# Altium schematic sheet Nucleo PCB V1.1.SchDoc
size A2; SheetNumber: 1; SheetTotal: 1
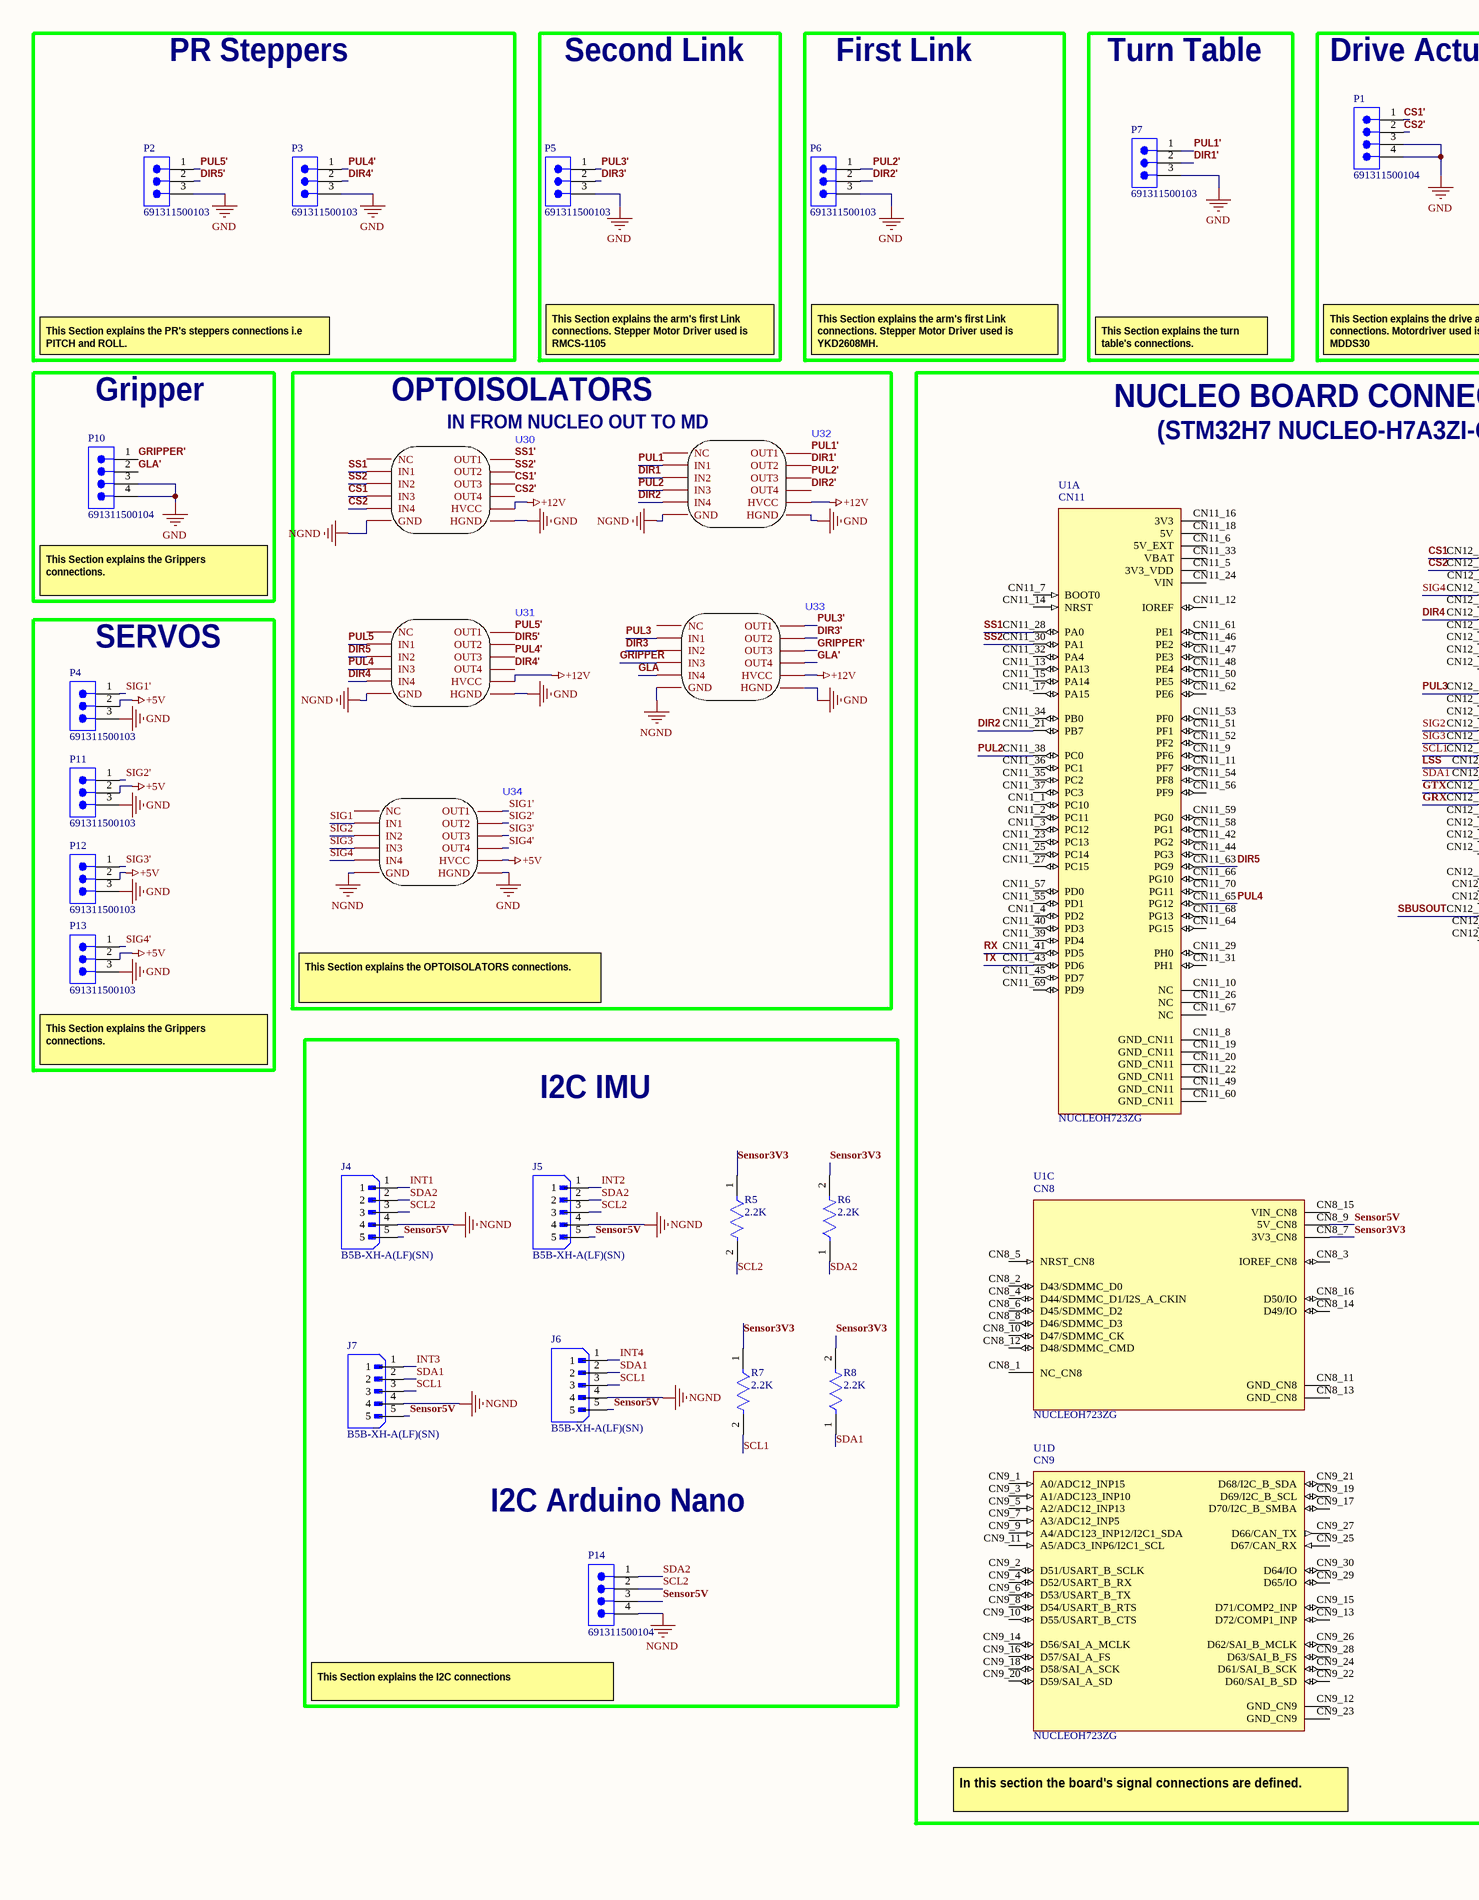
[diagram p0: Nucleo PCB V1.1.SchDoc, left]
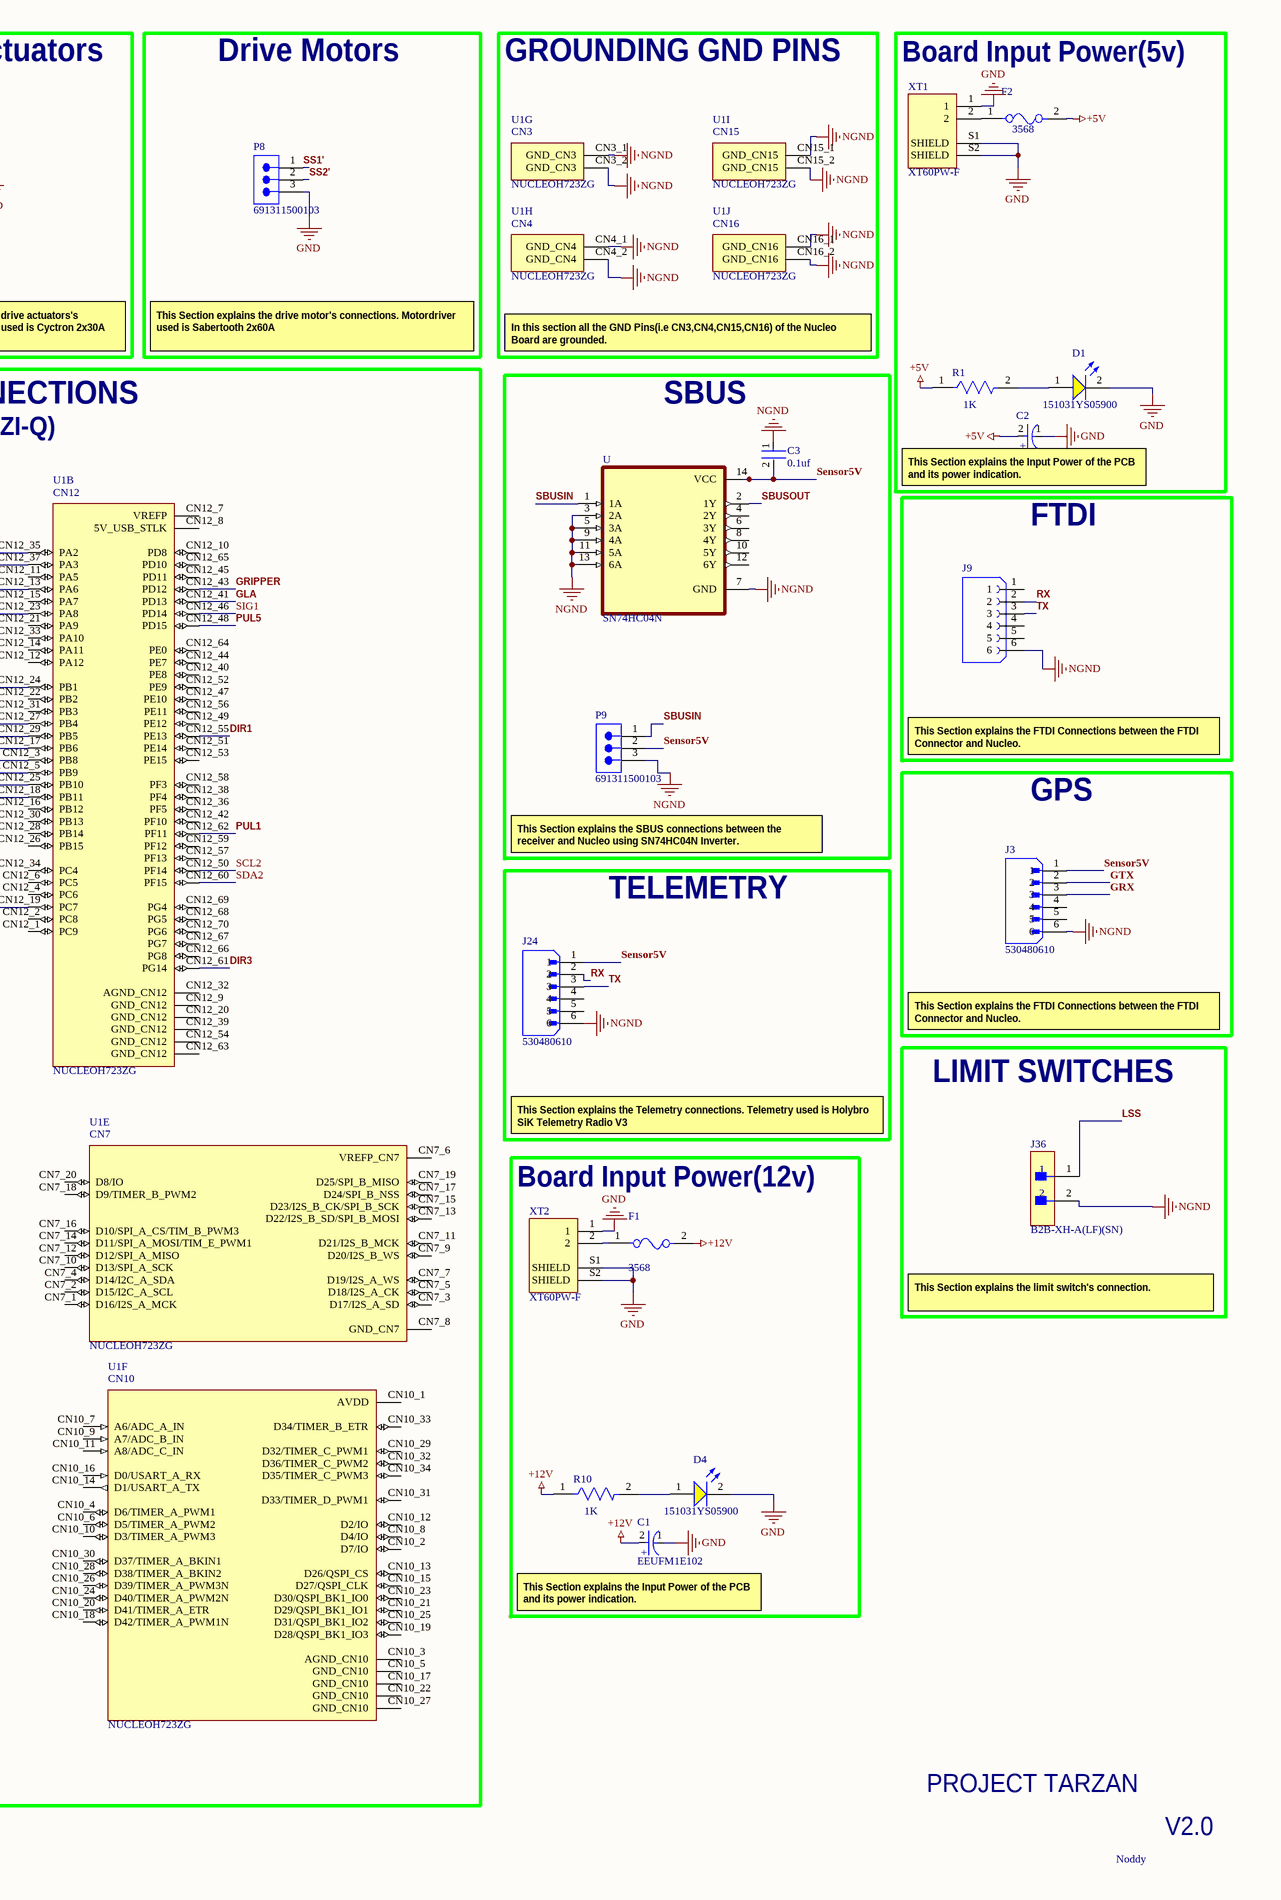
[diagram p1: Nucleo PCB V1.1.SchDoc, right]

## Parts
C1  EEUFM1E102  [FP-RAD-TH-D_12_5_0_5-L_20-MFG]
C2  EEUFM1E102  [FP-RAD-TH-D_12_5_0_5-L_20-MFG]
C3  0.1uf  [FP-VY1472M63Y5UQ6TV0-MFG]
D1  151031YS05900  [WL-TMRC_D3.95H5.3]
D4  151031YS05900  [WL-TMRC_D3.95H5.3]
F1  3568  [FP-3568-MFG]
F2  3568  [FP-3568-MFG]
J3  530480610  [MOLEX_530480610]
J4  B5B-XH-A(LF)(SN)  [JST_B5B-XH-A(LF)(SN)]
J5  B5B-XH-A(LF)(SN)  [JST_B5B-XH-A(LF)(SN)]
J6  B5B-XH-A(LF)(SN)  [JST_B5B-XH-A(LF)(SN)]
J7  B5B-XH-A(LF)(SN)  [JST_B5B-XH-A(LF)(SN)]
J9  PPTC061LFBN-RC  [SULLINS_PPTC061LFBN-RC]  (value not drawn)
J24  530480610  [MOLEX_530480610]
J36  B2B-XH-A(LF)(SN)  [FP-B2B-XH-A_LF_SN-MFG]
P1  691311500104  [691311500104]
P2  691311500103  [691311500103]
P3  691311500103  [691311500103]
P4  691311500103  [691311500103]
P5  691311500103  [691311500103]
P6  691311500103  [691311500103]
P7  691311500103  [691311500103]
P8  691311500103  [691311500103]
P9  691311500103  [691311500103]
P10  691311500104  [691311500104]
P11  691311500103  [691311500103]
P12  691311500103  [691311500103]
P13  691311500103  [691311500103]
P14  691311500104  [691311500104]
R1  1K  [FP-MRS25-MFG]
R5  2.2K  [FP-MRS25-MFG]
R6  2.2K  [FP-MRS25-MFG]
R7  2.2K  [FP-MRS25-MFG]
R8  2.2K  [FP-MRS25-MFG]
R10  1K  [FP-MRS25-MFG]
U  SN74HC04N  [DIP794W45P254L1969H508Q14]
U1  NUCLEOH723ZG  [MODULE_NUCLEOH723ZG]  (parts A,B,C,D,E,F,G,H,I,J of 10)
U30  (no value)  [TLP281-4 (4 CHANNEL OPTOISOLATOR)]
U31  (no value)  [TLP281-4 (4 CHANNEL OPTOISOLATOR)]
U32  (no value)  [TLP281-4 (4 CHANNEL OPTOISOLATOR)]
U33  (no value)  [TLP281-4 (4 CHANNEL OPTOISOLATOR)]
U34  (no value)  [TLP281-4 (4 CHANNEL OPTOISOLATOR)]
XT1  XT60PW-F  [AMASS_XT60PW-F]
XT2  XT60PW-F  [AMASS_XT60PW-F]

## Blocks framed on the sheet
PR Steppers: P2 P3
Second Link: P5
First Link: P6
Turn Table: P7
Drive Actuators: P1
Drive Motors: P8
GROUNDING GND PINS: U1
Board Input Power(5v): C2 D1 F2 R1 XT1
Gripper: P10
OPTOISOLATORS: U30-U34
NUCLEO BOARD CONNECTIONS: U1
SBUS: C3 P9 U
FTDI: J9
SERVOS: P4 P11-P13
GPS: J3
TELEMETRY: J24
LIMIT SWITCHES: J36
Board Input Power(12v): C1 D4 F1 R10 XT2

## Nets
+5V: C2.2(A) F2.2 P4.2 P11.2 P12.2 P13.2 R1.1 U34.5(HVCC)
+12V: C1.2(A) F1.2 R10.1 U30.5(HVCC) U31.5(HVCC) U32.5(HVCC) U33.5(HVCC)
GND: C1.1(C) C2.1(C) D1.2(K) D4.2(K) P1.3 P1.4 P2.3 P3.3 P4.3 P5.3 P6.3 P7.3 P8.3 P10.3 P10.4 P11.3 P12.3 P13.3 U30.6(HGND) U31.6(HGND) U32.6(HGND) U33.6(HGND) U34.6(HGND) XT1.1 XT1.S1(SHIELD) XT1.S2(SHIELD) XT2.1 XT2.S1(SHIELD) XT2.S2(SHIELD)
NGND: C3.1 J3.6 J4.4 J5.4 J6.4 J7.4 J9.6 J24.6 J36.2 P9.3 P14.4 U.3(2A) U.5(3A) U.7(GND) U.9(4A) U.11(5A) U.13(6A) U1.CN3_1(GND_CN3) U1.CN3_2(GND_CN3) U1.CN4_1(GND_CN4) U1.CN4_2(GND_CN4) U1.CN15_1(GND_CN15) U1.CN15_2(GND_CN15) U1.CN16_1(GND_CN16) U1.CN16_2(GND_CN16) U30.7(GND) U31.7(GND) U32.7(GND) U33.7(GND) U34.7(GND)
CS1: U1.CN12_35(PA2) U30.9(IN3)
CS1': P1.1 U30.3(OUT3)
CS2: U1.CN12_37(PA3) U30.8(IN4)
CS2': P1.2 U30.4(OUT4)
DIR1: U1.CN12_55(PE13) U32.10(IN2)
DIR1': P7.2 U32.2(OUT2)
DIR2: U1.CN11_21(PB7) U32.8(IN4)
DIR2': P6.2 U32.4(OUT4)
DIR3: U1.CN12_61(PG14) U33.10(IN2)
DIR3': P5.2 U33.2(OUT2)
DIR4: U1.CN12_23(PA8) U31.8(IN4)
DIR4': P3.2 U31.4(OUT4)
DIR5: U1.CN11_63(PG9) U31.10(IN2)
DIR5': P2.2 U31.2(OUT2)
GLA: U1.CN12_41(PD13) U33.8(IN4)
GLA': P10.2 U33.4(OUT4)
GRIPPER: U1.CN12_43(PD12) U33.9(IN3)
GRIPPER': P10.1 U33.3(OUT3)
GRX: J3.3 U1.CN12_18(PB11)
GTX: J3.2 U1.CN12_25(PB10)
INT1: J4.1
INT2: J5.1
INT3: J7.1
INT4: J6.1
LSS: J36.1 U1.CN12_3(PB8)
PUL1: U1.CN12_62(PF11) U32.11(IN1)
PUL1': P7.1 U32.1(OUT1)
PUL2: U1.CN11_38(PC0) U32.9(IN3)
PUL2': P6.1 U32.3(OUT3)
PUL3: U1.CN12_24(PB1) U33.11(IN1)
PUL3': P5.1 U33.1(OUT1)
PUL4: U1.CN11_65(PG12) U31.9(IN3)
PUL4': P3.1 U31.3(OUT3)
PUL5: U1.CN12_48(PD15) U31.11(IN1)
PUL5': P2.1 U31.1(OUT1)
RX: J9.2 J24.2 U1.CN11_41(PD5)
SBUSIN: P9.1 U.1(1A)
SBUSOUT: U.2(1Y) U1.CN12_19(PC7)
SCL1: J6.3 J7.3 R7.2 U1.CN12_17(PB6)
SCL2: J4.3 J5.3 P14.2 R5.2 U1.CN12_50(PF14)
SDA1: J6.2 J7.2 R8.1 U1.CN12_5(PB9)
SDA2: J4.2 J5.2 P14.1 R6.1 U1.CN12_60(PF15)
Sensor3V3: R5.1 R6.2 R7.1 R8.2 U1.CN8_7(3V3_CN8)
Sensor5V: C3.2 J3.1 J4.5 J5.5 J6.5 J7.5 J24.1 P9.2 P14.3 U.14(VCC) U1.CN8_9(5V_CN8)
SIG1: U1.CN12_46(PD14) U34.11(IN1)
SIG1': P4.1 U34.1(OUT1)
SIG2: U1.CN12_27(PB4) U34.10(IN2)
SIG2': P11.1 U34.2(OUT2)
SIG3: U1.CN12_29(PB5) U34.9(IN3)
SIG3': P12.1 U34.3(OUT3)
SIG4: U1.CN12_13(PA6) U34.8(IN4)
SIG4': P13.1 U34.4(OUT4)
SS1: U1.CN11_28(PA0) U30.11(IN1)
SS1': P8.1 U30.1(OUT1)
SS2: U1.CN11_30(PA1) U30.10(IN2)
SS2': P8.2 U30.2(OUT2)
TX: J9.3 J24.3 U1.CN11_43(PD6)
NetD1_1: D1.1(A) R1.2
NetD4_1: D4.1(A) R10.2
NetF1_1: F1.1 XT2.2
NetF2_1: F2.1 XT1.2

Not connected (* = marked no-connect by the designer): J3 4 5; J9 1 4 5; J24 4 5; U 4(2Y) 6(3Y) 8(4Y) 10(5Y) 12(6Y); U1 CN7_1(D16/I2S_A_MCK) CN7_2(D15/I2C_A_SCL) CN7_3(D17/I2S_A_SD) CN7_4(D14/I2C_A_SDA) CN7_5(D18/I2S_A_CK) CN7_6(VREFP_CN7) CN7_7(D19/I2S_A_WS) CN7_8(GND_CN7) CN7_9(D20/I2S_B_WS) CN7_10(D13/SPI_A_SCK) CN7_11(D21/I2S_B_MCK) CN7_12(D12/SPI_A_MISO) CN7_13(D22/I2S_B_SD/SPI_B_MOSI) CN7_14(D11/SPI_A_MOSI/TIM_E_PWM1) CN7_15(D23/I2S_B_CK/SPI_B_SCK) CN7_16(D10/SPI_A_CS/TIM_B_PWM3) CN7_17(D24/SPI_B_NSS) CN7_18(D9/TIMER_B_PWM2) CN7_19(D25/SPI_B_MISO) CN7_20(D8/IO) CN8_1(NC_CN8) CN8_2(D43/SDMMC_D0) CN8_3(IOREF_CN8) CN8_4(D44/SDMMC_D1/I2S_A_CKIN) CN8_5(NRST_CN8) CN8_6(D45/SDMMC_D2) CN8_8(D46/SDMMC_D3) CN8_10(D47/SDMMC_CK) CN8_11(GND_CN8) CN8_12(D48/SDMMC_CMD) CN8_13(GND_CN8) CN8_14(D49/IO) CN8_15(VIN_CN8) CN8_16(D50/IO) CN9_1(A0/ADC12_INP15) CN9_2(D51/USART_B_SCLK) CN9_3(A1/ADC123_INP10) CN9_4(D52/USART_B_RX) CN9_5(A2/ADC12_INP13) CN9_6(D53/USART_B_TX) CN9_7(A3/ADC12_INP5) CN9_8(D54/USART_B_RTS) CN9_9(A4/ADC123_INP12/I2C1_SDA) CN9_10(D55/USART_B_CTS) CN9_11(A5/ADC3_INP6/I2C1_SCL) CN9_12(GND_CN9) CN9_13(D72/COMP1_INP) CN9_14(D56/SAI_A_MCLK) CN9_15(D71/COMP2_INP) CN9_16(D57/SAI_A_FS) CN9_17(D70/I2C_B_SMBA) CN9_18(D58/SAI_A_SCK) CN9_19(D69/I2C_B_SCL) CN9_20(D59/SAI_A_SD) CN9_21(D68/I2C_B_SDA) CN9_22(D60/SAI_B_SD) CN9_23(GND_CN9) CN9_24(D61/SAI_B_SCK) CN9_25(D67/CAN_RX) CN9_26(D62/SAI_B_MCLK) CN9_27(D66/CAN_TX) CN9_28(D63/SAI_B_FS) CN9_29(D65/IO) CN9_30(D64/IO) CN10_1(AVDD) CN10_2(D7/IO) CN10_3(AGND_CN10) CN10_4(D6/TIMER_A_PWM1) CN10_5(GND_CN10) CN10_6(D5/TIMER_A_PWM2) CN10_7(A6/ADC_A_IN) CN10_8(D4/IO) CN10_9(A7/ADC_B_IN) CN10_10(D3/TIMER_A_PWM3) CN10_11(A8/ADC_C_IN) CN10_12(D2/IO) CN10_13(D26/QSPI_CS) CN10_14(D1/USART_A_TX) CN10_15(D27/QSPI_CLK) CN10_16(D0/USART_A_RX) CN10_17(GND_CN10) CN10_18(D42/TIMER_A_PWM1N) CN10_19(D28/QSPI_BK1_IO3) CN10_20(D41/TIMER_A_ETR) CN10_21(D29/QSPI_BK1_IO1) CN10_22(GND_CN10) CN10_23(D30/QSPI_BK1_IO0) CN10_24(D40/TIMER_A_PWM2N) CN10_25(D31/QSPI_BK1_IO2) CN10_26(D39/TIMER_A_PWM3N) CN10_27(GND_CN10) CN10_28(D38/TIMER_A_BKIN2) CN10_29(D32/TIMER_C_PWM1) CN10_30(D37/TIMER_A_BKIN1) CN10_31(D33/TIMER_D_PWM1) CN10_32(D36/TIMER_C_PWM2) CN10_33(D34/TIMER_B_ETR) CN10_34(D35/TIMER_C_PWM3) CN11_1(PC10) CN11_2(PC11) CN11_3(PC12) CN11_4(PD2) CN11_5(3V3_VDD) CN11_6(5V_EXT) CN11_7(BOOT0) CN11_8(GND_CN11) CN11_9(PF6) CN11_10(NC) CN11_11(PF7) CN11_12(IOREF) CN11_13(PA13) CN11_14(NRST) CN11_15(PA14) CN11_16(3V3) CN11_17(PA15) CN11_18(5V) CN11_19(GND_CN11) CN11_20(GND_CN11) CN11_22(GND_CN11) CN11_23(PC13) CN11_24(VIN) CN11_25(PC14) CN11_26(NC) CN11_27(PC15) CN11_29(PH0) CN11_31(PH1) CN11_32(PA4) CN11_33(VBAT) CN11_34(PB0) CN11_35(PC2) CN11_36(PC1) CN11_37(PC3) CN11_39(PD4) CN11_40(PD3) CN11_42(PG2) CN11_44(PG3) CN11_45(PD7) CN11_46(PE2) CN11_47(PE3) CN11_48(PE4) CN11_49(GND_CN11) CN11_50(PE5) CN11_51(PF1) CN11_52(PF2) CN11_53(PF0) CN11_54(PF8) CN11_55(PD1) CN11_56(PF9) CN11_57(PD0) CN11_58(PG1) CN11_59(PG0) CN11_60(GND_CN11) CN11_61(PE1) CN11_62(PE6) CN11_64(PG15) CN11_66(PG10) CN11_67(NC) CN11_68(PG13) CN11_69(PD9) CN11_70(PG11) CN12_1(PC9) CN12_2(PC8) CN12_4(PC6) CN12_6(PC5) CN12_7(VREFP) CN12_8(5V_USB_STLK) CN12_9(GND_CN12) CN12_10(PD8) CN12_11(PA5) CN12_12(PA12) CN12_14(PA11) CN12_15(PA7) CN12_16(PB12) CN12_20(GND_CN12) CN12_21(PA9) CN12_22(PB2) CN12_26(PB15) CN12_28(PB14) CN12_30(PB13) CN12_31(PB3) CN12_32(AGND_CN12) CN12_33(PA10) CN12_34(PC4) CN12_36(PF5) CN12_38(PF4) CN12_39(GND_CN12) CN12_40(PE8) CN12_42(PF10) CN12_44(PE7) CN12_45(PD11) CN12_47(PE10) CN12_49(PE12) CN12_51(PE14) CN12_52(PE9) CN12_53(PE15) CN12_54(GND_CN12) CN12_56(PE11) CN12_57(PF13) CN12_58(PF3) CN12_59(PF12) CN12_63(GND_CN12) CN12_64(PE0) CN12_65(PD10) CN12_66(PG8) CN12_67(PG7) CN12_68(PG5) CN12_69(PG4) CN12_70(PG6); U30 12(NC); U31 12(NC); U32 12(NC); U33 12(NC); U34 12(NC)

## Notes on the sheet
- This Section explains the PR's steppers connections i.e PITCH and ROLL.
- This Section explains the arm's first Link connections. Stepper Motor Driver used is RMCS-1105
- This Section explains the arm's first Link connections. Stepper Motor Driver used is YKD2608MH.
- This Section explains the turn table's connections.
- This Section explains the drive actuators's connections. Motordriver used is Cyctron 2x30A MDDS30
- This Section explains the drive motor's connections. Motordriver used is Sabertooth 2x60A
- In this section all the GND Pins(i.e CN3,CN4,CN15,CN16) of the Nucleo Board are grounded.
- IN FROM NUCLEO OUT TO MD
- (STM32H7 NUCLEO-H7A3ZI-Q)
- (near C2) This Section explains the Input Power of the PCB and its power indication.
- This Section explains the Grippers connections.
- This Section explains the FTDI Connections between the FTDI Connector and Nucleo.
- This Section explains the SBUS connections between the receiver and Nucleo using SN74HC04N Inverter.
- This Section explains the OPTOISOLATORS connections.
- (near P13) This Section explains the Grippers connections.
- I2C IMU
- This Section explains the Telemetry connections. Telemetry used is Holybro SiK Telemetry Radio V3
- This Section explains the limit switch's connection.
- I2C Arduino Nano
- (near C1) This Section explains the Input Power of the PCB and its power indication.
- This Section explains the I2C connections
- In this section the board's signal connections are defined.
- PROJECT TARZAN
- Noddy
- V2.0
- (in symbol CMP-013-000000-1, part A) CN11
- (in symbol CMP-013-000000-1, part B) CN12
- (in symbol CMP-013-000000-1, part C) CN8
- (in symbol CMP-013-000000-1, part D) CN9
- (in symbol CMP-013-000000-1, part E) CN7
- (in symbol CMP-013-000000-1, part F) CN10
- (in symbol CMP-013-000000-1, part G) CN3
- (in symbol CMP-013-000000-1, part H) CN4
- (in symbol CMP-013-000000-1, part I) CN15
- (in symbol CMP-013-000000-1, part J) CN16
- (in symbol CMP-05427-000606-1) +

## Library data of the parts
C1 C2 = CMP-05427-000606-1: Aluminum Electrolytic Capacitors (Radial Lead Type) 1000uF ±20% 25V; Lead Length: 17mm; ESR (Equivalent Series Resistance): 18mR; Dissipation Factor: 0.14%; Lead Diameter: 0.6mm; Dielectric Material: Aluminium; Capacitance: 1mF; Life (Hours): 5000Hour; Ripple Current: 2.6A; Contact Plating: Tin; Voltage: 25V; Length: 20mm; Packaging: Bulk; RoHS Compliant: Yes; REACH SVHC: Yes; Lead Free: Lead Free; Tolerance: 20%; Features: General Purpose; Construction: RADIAL; Lead Pitch: 5mm; Impedance: 18mR; Min Operating Temperature: -40°C; Case/Package: Radial; Diameter: 12.5mm; Height - Seated (Max): 0.787inch; Package Quantity: 200; Mount: Through Hole; Max Operating Temperature: 105°C; Series: FM; Height: 20mm; Voltage Rating (DC): 25V; Termination: Radial; Voltage Rating: 25V; Radiation Hardening: No
C3 = CMP-02417-000050-1: CAP CER 4700PF 760VAC Y5U RADIAL; Voltage Rating (AC): 500V; Lead Diameter: 0.6mm; Capacitance: 4.7nF; Tolerance: 20%; Lead/Base Style: Kinked; Termination: Radial; Resistor Type: Ceramic; Radiation Hardening: No; Diameter: 16mm; Max Operating Temperature: 125°C; Case/Package: Radial; Thickness: 5mm; Lead Pitch: 10mm; Series: VY1; Contact Plating: Tin; Depth: 5mm; RoHS Compliant: Yes; Voltage: 500V; Voltage Rating (DC): 500V; Package Quantity: 500; Construction: RADIAL; Min Operating Temperature: -40°C; Height: 19mm; Height - Seated (Max): 0.787inch; Packaging: Tape and Reel; Dielectric: Y5U; Mount: Through Hole
D1 D4 = CMP-1488-00003-2: NexarPartId: 29717806; Wavelength: 585nm; Color: Yellow; Forward Voltage: 2.1V; Lens Style: Circular, Diffused, Round; Viewing Angle: 60°; Forward Current: 100mA; Dominant Wavelength: 590nm; Test Current: 20mA; Max Reverse Voltage (DC): 5V; Luminous Intensity: 30mcd; Lens Size: 3mm; Max Operating Temperature: 85°C; Mount: Through Hole; Length: 3mm; Packaging: Bulk; Width: 3mm; Height: 5.3mm; Min Operating Temperature: -40°C; RoHS: Compliant; REACH SVHC: Unknown; Case/Package: Radial; Peak Wavelength: 585nm
F1 F2 = CMP-2000-05464-2: NexarPartId: 8116161; Approvals: UL; Body Material: Nylon; Illumination Type: Illuminated; Voltage Rating (AC): 500V; Current Rating: 20A; Number of Poles: 1; Color: Black; Material: Brass, Nylon, Tin; Depth: 6.73mm; Max Operating Temperature: 145°C; Length: 16mm; Mount: PCB, Vertical; REACH SVHC: No SVHC; Lead Free: Lead Free; Min Operating Temperature: -50°C; Flammability Rating: UL94 V-0; RoHS: Compliant; Orientation: Vertical; Fuse Current: 20A; Termination: PC Pin; Number of Circuits: 1; Contact Plating: Tin; Voltage: 500V; Contact Material: Brass
J4-J7 = B5B-XH-A(LF)(SN): Connector Header Through Hole 5 position 0.098 (2.50mm); MF: JST Sales America Inc.; SnapEDA_Link: https://www.snapeda.com/parts/B5B-XH-A(LF)(SN)/JST+Sales+America+Inc./view-part/?ref=snap; Package: None; Value: *; MP: B5B-XH-A(LF)(SN); Check_prices: https://www.snapeda.com/parts/B5B-XH-A(LF)(SN)/JST+Sales+America+Inc./view-part/?ref=eda
J9 = PPTC061LFBN-RC: 6 Position Header Connector 0.100 (2.54mm) Through Hole Tin; MF: Sullins Connector; SnapEDA_Link: https://www.snapeda.com/parts/PPTC061LFBN-RC/Sullins+Connector+Solutions/view-part/?ref=snap; Package: None; Value: *; MP: PPTC061LFBN-RC; Check_prices: https://www.snapeda.com/parts/PPTC061LFBN-RC/Sullins+Connector+Solutions/view-part/?ref=eda
J36 = CMP-2000-05888-3: CONN HEADER VERT 2POS 2.5MM; Current Rating: 3A; Voltage Rating: 250V; Number of Contacts: 2; Contact Resistance: 20mR; Wire/Cable Gauge: 22AWG; Insulation Resistance: 1GR; Connector Type: Male Pin; Packaging: Bulk; Contact Material: Brass; Lead Free: Lead Free; Orientation: Straight; Contact Plating: Tin; Max Current Rating: 3A; Termination: Solder; Fastening Type: Detent; Depth: 5.75mm; Housing Material: Polyamide; REACH SVHC: No SVHC; Series: XH; Voltage Rating (AC): 250V; Number of Positions: 2; Color: Natural; Contact Type: Male Pin; Max Voltage Rating (DC): 250V; Pitch: 2.5mm; Lead Pitch: 2.5mm; Mount: Through Hole; Max Operating Temperature: 85°C; Length: 7.4mm; Max Voltage Rating (AC): 250V; Min Operating Temperature: -25°C; Number of Rows: 1; Housing Color: White
P1 P10 P14 = CMP-1502-02148-2: NexarPartId: 8917749; Pitch: 5.08mm; Number of Positions Per Level: 4; Gender: Male; Voltage: 300V; Current: 20A; Number of Levels: 1; Orientation: Vertical; Number of Pins: 4; Mount: Through Hole; Number of Contacts: 4; Length: 8.5mm; Number of Rows: 1; Contact Plating: Tin; Color: Green; Termination: Solder; Contact Material: Brass; REACH SVHC: Unknown; RoHS: Compliant; Lead Pitch: 5.08mm; Width: 22.32mm; Height: 12mm; Packaging: Box
P2-P9 P11-P13 = CMP-1502-02147-2: NexarPartId: 8917748; Current: 20A; Number of Positions Per Level: 3; Voltage: 300V; Gender: Male; Pitch: 5.08mm; Number of Levels: 1; REACH SVHC: Unknown; Contact Material: Brass; Number of Contacts: 3; Mount: Through Hole; Number of Pins: 3; Packaging: Box; Contact Plating: Tin; Height: 12mm; Termination: Solder; RoHS: Compliant; Color: Green; Number of Rows: 1; Width: 17.24mm; Lead Pitch: 5.08mm; Length: 8.5mm; Orientation: Vertical
R1 R5-R8 R10 = CMP-00030-42757237-1: MRS25000C1000FRP00 Resistor, 100 Ohm, ± 1%, 600 mW, Axial Leaded, Metal Film (Thin Film), Professional; Max Power Dissipation: 600mW; Resistance: 100Ω; Voltage Rating: 350V; Temperature Coefficient: 50ppm/°C; Lead Diameter: 600µm; RoHS: Compliant; Radiation Hardening: No; Schedule B: 8533210090, 8533210090; Length: 6.5mm; Packaging: Tape & Reel (TR); Number of Terminations: 2; Mount: Through Hole; Width: 2.5mm; Tolerance: 1%; Military Standard: Not; Voltage Rating (DC): 350V; Contact Plating: Tin; Number of Pins: 2; Max Operating Temperature: 155°C; NexarPartId: 42757237; Diameter: 2.5mm; Composition: Metal Film, Thin Film; REACH SVHC: Unknown; Power Rating: 600mW; Lead Free: Lead Free; Termination: Axial; Case/Package: Axial; Min Operating Temperature: -55°C
U = SN74HC04N: Hex Inverters 14-PDIP -40 to 85; MF: Texas Instruments; Texas_Instruments-Purchase-URL: https://snapeda.com/shop?store=Texas+Instruments&id=279498; SnapEDA_Link: https://www.snapeda.com/parts/SN74HC04N/Texas%20Instruments/view-part/279498/?ref=snap; Mouser-Purchase-URL: https://snapeda.com/shop?store=Mouser&id=279498; DigiKey-Purchase-URL: https://snapeda.com/shop?store=DigiKey&id=279498; MP: SN74HC04N; Package: PDIP-14 Texas Instruments; Value: *; Arrow_Electronics-Purchase-URL: https://snapeda.com/shop?store=Arrow+Electronics&id=279498; BuyPart: https://www.snapeda.com/parts/SN74HC04N/Texas%20Instruments/view-part/279498/?ref=eda
U1 = CMP-013-000000-1: STM32H723ZG Nucleo-144 STM32H7 STM32 MCU 32-Bit Embedded Evaluation Board; MF: STMicroelectronics; Availability: In Stock; Design Item ID: NUCLEOH723ZG; Package: None; Price: None; Pin Count: 248; Value: *; Purchase-URL: https://pricing.snapeda.com/search/part/NUCLEOH723ZG/?ref=eda; Source: NUCLEOH723ZG.SchLib; MP: NUCLEOH723ZG; SnapEDA_Link: https://www.snapeda.com/parts/NUCLEOH723ZG/STMicroelectronics/view-part/?ref=snap; Check_prices: https://www.snapeda.com/parts/NUCLEOH723ZG/STMicroelectronics/view-part/?ref=eda; Component Type: Standard
U30-U34 = TLP281-4 optoisolator module_vk
XT1 XT2 = CMP-007-000000-1: Socket DC Supply Connector Female; MF: AMASS; Check_prices: https://www.snapeda.com/parts/XT60PW-F/AMASS/view-part/?ref=eda; MP: XT60PW-F; Source: XT60PW-F.SchLib; Component Type: Standard; Package: Package; Value: *; SnapEDA_Link: https://www.snapeda.com/parts/XT60PW-F/AMASS/view-part/?ref=snap; Pin Count: 4; Price: None; Availability: Not in stock; Design Item ID: XT60PW-F
J3 J24 = 530480610: Package: None; Price: None; Value: *; MP: 530480610; Availability: Unavailable